# Altium project Battman.PrjPcb (part 2 of 2)

## Sheet CAN.SchDoc
size A; SheetNumber: 9
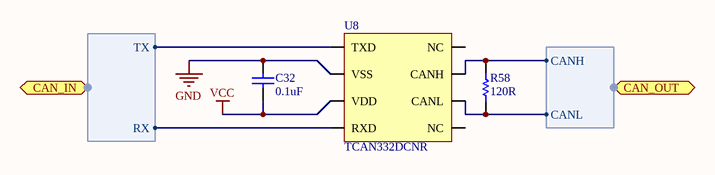
[diagram p9: CAN.SchDoc]

### Parts
C32  value 0.1uF  [C0402[1005X55]]  (hidden comment: 0.1uF 6.3V 0402)
R58  value 120R  [R0402[1005]]  (hidden comment: 120R 1% 0402)
U8  TCAN332DCNR  [SOT-23-8]

### Ports
CAN_IN (harness CAN Input), CAN_OUT (harness CAN Output)

### Harnesses
CAN Input: TX, RX
CAN Output: CANH, CANL

### Nets
GND: C32.1 U8.2(VSS)
VCC: C32.2 U8.3(VDD)
CAN.RX: U8.4(RXD) ; port CAN_IN.RX
CAN.TX: U8.1(TXD) ; port CAN_IN.TX
NetJP3_1: R58.2 U8.7(CANH) ; port CAN_OUT.CANH
NetJP3_2: R58.1 U8.6(CANL) ; port CAN_OUT.CANL

Not connected (* = marked no-connect by the designer): U8 5(NC) 8(NC)

### Library data of the parts
C32 = CAP_0.1uF_6.3V_0402_10%: 0.1uF 6.3V 10% 0402 (1005 Metric); PartNumber: GRM155R70J104KA01D; Manufacturer: Murata; Tolerance: 10%; Mounting Technology: Surface Mount; PackageReference: 0402; PackageDescription: 0402 (1005 Metric); Voltage: 6.3V
R58 = RES_120R_0402_1%: 120R 0.063W 1% 0402 (1005 Metric); Manufacturer: KOA Speer; PartNumber: RK73H1ETTP1200F; Tolerance: 1%; Power: 0.063W; Mounting Technology: Surface Mount; PackageReference: 0402; PackageDescription: 0402 (1005 Metric); ComponentLink1Description: Datasheet; ComponentLink1URL: http://www.koaspeer.com/catimages/Products/RK73H/RK73H.pdf
U8 = TCAN332DCNR: CAN Interface IC 3.3-V CAN Transceivers with CAN FD (Flexible Data Rate) 8-SOT-23 -40 to 125; Manufacturer: Texas Instruments; Mounting Technology: Surface Mount; PackageReference: SOT-23-8; PackageDescription: SOT23, 8-Leads; PartNumber: TCAN332DCNR

## Sheet RTCC.SchDoc
size A; SheetNumber: 10
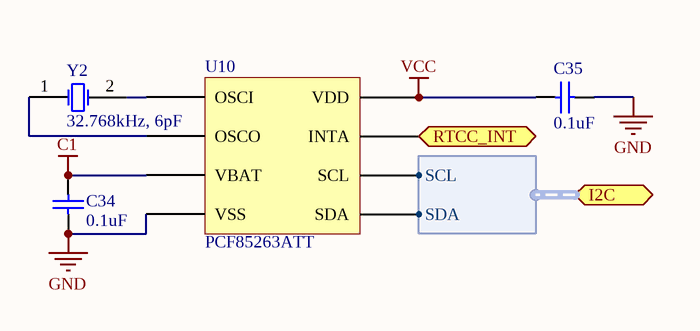
[diagram p10: RTCC.SchDoc]

### Parts
C34  value 0.1uF  [C0402[1005X55]]  (hidden comment: 0.1uF 6.3V 0402)
C35  value 0.1uF  [C0402[1005X55]]  (hidden comment: 0.1uF 6.3V 0402)
U10  PCF85263ATT  [TSSOP-8]
Y2  32.768kHz, 6pF  [ST3215SB]

### Ports
I2C (harness I2C), RTCC_INT (out)

### Harnesses
I2C: SCL, SDA

### Nets
C1: C34.2 U10.3(VBAT)
GND: C34.1 C35.2 U10.4(VSS)
VCC: C35.1 U10.8(VDD)
I2C.SCL: U10.6(SCL) ; port I2C.SCL
I2C.SDA: U10.5(SDA) ; port I2C.SDA
NetQ9_1: U10.7(INTA) ; port RTCC_INT
NetU10_1: U10.1(OSCI) Y2.2(X2)
NetU10_2: U10.2(OSCO) Y2.1(X1)

### Library data of the parts
C34 C35 = CAP_0.1uF_6.3V_0402_10%: as C32 on sheet CAN; Mounting Technology: Surface Mount; PackageReference: 0402; PackageDescription: 0402 (1005 Metric); Voltage: 6.3V; Tolerance: 10%
U10 = PCF85263ATT: Real Time Clock Real-Time Clock calendar; PartNumber: PCF85263ATT/AJ; Manufacturer: Texas Instruments; Mounting Technology: Surface Mount; PackageReference: TSSOP-8
Y2 = ST3215SB32768B0HPWB3: 32.768kHz ±20ppm Crystal 6pF 60 kOhm -40°C ~ 85°C Surface Mount 2-SMD, No Lead (DFN, LCC); Manufacturer: AVX/Kyocera; PackageDescription: 2-SMD, No Lead (DFN, LCC); PackageReference: ST3215SB; Mounting Technology: Surface Mount; PartNumber: ST3215SB32768B0HPWB3

## Sheet Buzzer.SchDoc
size A; SheetNumber: 11
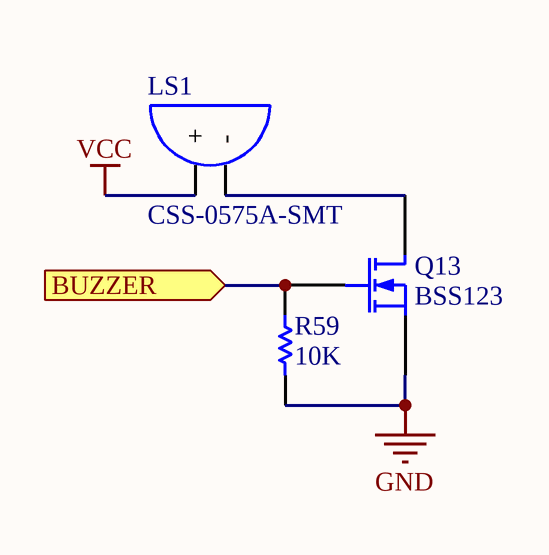
[diagram p11: Buzzer.SchDoc]

### Parts
LS1  CSS-0575A-SMT  [CSS-0575A-SMT]
Q13  BSS123  [SOT323-3]
R59  value 10K  [R0402[1005]]  (hidden comment: 10K 1% 0402)

### Ports
BUZZER (in)

### Nets
GND: Q13.2(S) R59.1
VCC: LS1.1(+)
NetLS1_2: LS1.2(-) Q13.3(D)
NetQ13_1: Q13.1(G) R59.2 ; port BUZZER

### Library data of the parts
LS1 = CSS-0575A-SMT: Magnetic Buzzer Transducer; Manufacturer: CUI, Inc.; PartNumber: CSS-0575A-SMT; Mounting Technology: Surface Mount; PackageReference: 5x5x1.9mm
Q13 = BSS123WQ-7-F: N-Channel MOSFET; Manufacturer: Diodes Incorporated; PackageReference: SOT-323-3; PartNumber: BSS123WQ-7-F; Mounting Technology: Surface Mount
R59 = RES_10K_0402_1%: 10K 0.063W 1% 0402 (1005 Metric); Manufacturer: KOA Speer; PartNumber: RK73H1ETTP1002F; Tolerance: 1%; Power: 0.063W; Mounting Technology: Surface Mount; PackageReference: 0402; PackageDescription: 0402 (1005 Metric); ComponentLink1Description: Datasheet; ComponentLink1URL: http://www.koaspeer.com/catimages/Products/RK73H/RK73H.pdf

## Sheet Flash.SchDoc
size A; SheetNumber: 12
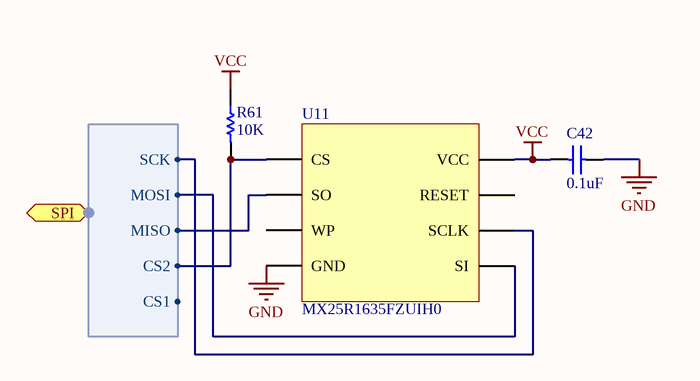
[diagram p12: Flash.SchDoc]

### Parts
C42  value 0.1uF  [C0402[1005X55]]  (hidden comment: 0.1uF 6.3V 0402)
R61  value 10K  [R0402[1005]]  (hidden comment: 10K 1% 0402)
U11  MX25R1635FZUIH0  [USON-8]

### Ports
SPI (harness SPI)

### Harnesses
SPI: SCK, MOSI, MISO, CS2, CS1

### Nets
GND: C42.2 U11.4(GND)
VCC: C42.1 R61.2 U11.8(VCC)
SPI.CS2: R61.1 U11.1(CS) ; port SPI.CS2
SPI.MISO: U11.2(SO) ; port SPI.MISO
SPI.MOSI: U11.5(SI) ; port SPI.MOSI
SPI.SCK: U11.6(SCLK) ; port SPI.SCK

Not connected (* = marked no-connect by the designer): U11 3(WP) 7(RESET)

### Library data of the parts
C42 = CAP_0.1uF_6.3V_0402_10%: as C32 on sheet CAN; Mounting Technology: Surface Mount; PackageReference: 0402; PackageDescription: 0402 (1005 Metric); Voltage: 6.3V; Tolerance: 10%
R61 = RES_10K_0402_1%: as R59 on sheet Buzzer; Tolerance: 1%; Power: 0.063W; Mounting Technology: Surface Mount; PackageReference: 0402; PackageDescription: 0402 (1005 Metric); ComponentLink1Description: Datasheet; ComponentLink1URL: http://www.koaspeer.com/catimages/Products/RK73H/RK73H.pdf
U11 = MX25R1635FZUIH0: pin to pad: 4>4+9; Manufacturer: Macronix; PartNumber: MX25R1635FZUIH0; Mounting Technology: Surface Mount; PackageReference: USON-8

## Nets that join several sheets
5V: 3V3 (5 pins), Connectors (JP5.5)
B+: Switches (D16.1), CurrentSense (R53.2)
C1: Switches (D18.1 Q9.2 R41.2), Connectors (*1.2), RTCC (C34.2 U10.3)
C+: Switches (R38.2), Charging (6 pins)
CHG+: Switches (5 pins), Charging (C22.1 D5.1 D6.1 R32.2), Connectors (JP4.2)
GND: 3V3 (16 pins), MCU (20 pins), Switches (21 pins), LTC6803 (5 pins), Charging (18 pins), Connectors (JP2.2 JP5.1 JP6.5 JP6.6), CurrentSense (C33.1 U9.1 U9.2 U9.7), CAN (C32.1 U8.2), RTCC (C34.1 C35.2 U10.4), Buzzer (Q13.2 R59.1), Flash (C42.2 U11.4)
V-: LTC6803 (5 pins), U_LTC6803/12 (C23_12.1), U_LTC6803/11 (C23_11.1), U_LTC6803/10 (C23_10.1), U_LTC6803/9 (C23_9.1), U_LTC6803/8 (C23_8.1), U_LTC6803/7 (C23_7.1), U_LTC6803/6 (C23_6.1), U_LTC6803/5 (C23_5.1), U_LTC6803/4 (C23_4.1), U_LTC6803/3 (C23_3.1), U_LTC6803/2 (C23_2.1), U_LTC6803/1 (C23_1.1)
VBB: Switches (8 pins), CurrentSense (R53.1)
VCC: 3V3 (5 pins), MCU (19 pins), Switches (U7.5 U7.7), LTC6803 (R1.1 R2.1 R3.1 R8.2), Charging (6 pins), Connectors (JP5.4), CurrentSense (C33.2 R52.2 U9.6), CAN (C32.2 U8.3), RTCC (C35.1 U10.8), Buzzer (LS1.1), Flash (C42.1 R61.2 U11.8)
VDD: 3V3 (C24.2 U5.2 U5.3), Switches (Q7.2 R57.2), LTC6803 (L1.1)
VUSB: 3V3 (D11.2 D15.1), MCU (R14.2), Connectors (JP6.1)
CELL0: LTC6803 (R10.2), U_LTC6803/1 (D9_1.C R35_1.1), Connectors (JP1.1)
CELL1: U_LTC6803/2 (D9_2.C R35_2.1), U_LTC6803/1 (Q3_1.2 R34_1.2), Connectors (*1.1 JP1.2)
CELL2: U_LTC6803/3 (D9_3.C R35_3.1), U_LTC6803/2 (Q3_2.2 R34_2.2), Connectors (JP1.3)
CELL3: U_LTC6803/4 (D9_4.C R35_4.1), U_LTC6803/3 (Q3_3.2 R34_3.2), Connectors (JP1.4)
CELL4: U_LTC6803/5 (D9_5.C R35_5.1), U_LTC6803/4 (Q3_4.2 R34_4.2), Connectors (JP1.5)
CELL5: U_LTC6803/6 (D9_6.C R35_6.1), U_LTC6803/5 (Q3_5.2 R34_5.2), Connectors (JP1.6)
CELL6: U_LTC6803/7 (D9_7.C R35_7.1), U_LTC6803/6 (Q3_6.2 R34_6.2), Connectors (JP1.7)
CELL7: U_LTC6803/8 (D9_8.C R35_8.1), U_LTC6803/7 (Q3_7.2 R34_7.2), Connectors (JP1.8)
CELL8: U_LTC6803/9 (D9_9.C R35_9.1), U_LTC6803/8 (Q3_8.2 R34_8.2), Connectors (JP1.9)
CELL9: U_LTC6803/10 (D9_10.C R35_10.1), U_LTC6803/9 (Q3_9.2 R34_9.2), Connectors (JP1.10)
CELL10: U_LTC6803/11 (D9_11.C R35_11.1), U_LTC6803/10 (Q3_10.2 R34_10.2), Connectors (JP1.11)
CELL11: U_LTC6803/12 (D9_12.C R35_12.1), U_LTC6803/11 (Q3_11.2 R34_11.2), Connectors (JP1.12)
CELL12: U_LTC6803/12 (Q3_12.2 R34_12.2), Connectors (JP1.13)
I2C.SCL: Charging (U4.3), CurrentSense (U9.5), RTCC (U10.6)
I2C.SDA: Charging (U4.4), CurrentSense (U9.4), RTCC (U10.5)
NetC1_2: LTC6803 (C1.2 R4.1 U1.32), Connectors (JP2.1)
NetC5_2: LTC6803 (C5.2 R10.1 U1.29), U_LTC6803/1 (D8_1.2)
NetC23_1_2: LTC6803 (U1.27), U_LTC6803/2 (D8_2.2), U_LTC6803/1 (C23_1.2 D8_1.1 R34_1.1)
NetC23_2_2: LTC6803 (U1.25), U_LTC6803/3 (D8_3.2), U_LTC6803/2 (C23_2.2 D8_2.1 R34_2.1)
NetC23_3_2: LTC6803 (U1.23), U_LTC6803/4 (D8_4.2), U_LTC6803/3 (C23_3.2 D8_3.1 R34_3.1)
NetC23_4_2: LTC6803 (U1.21), U_LTC6803/5 (D8_5.2), U_LTC6803/4 (C23_4.2 D8_4.1 R34_4.1)
NetC23_5_2: LTC6803 (U1.19), U_LTC6803/6 (D8_6.2), U_LTC6803/5 (C23_5.2 D8_5.1 R34_5.1)
NetC23_6_2: LTC6803 (U1.17), U_LTC6803/7 (D8_7.2), U_LTC6803/6 (C23_6.2 D8_6.1 R34_6.1)
NetC23_7_2: LTC6803 (U1.15), U_LTC6803/8 (D8_8.2), U_LTC6803/7 (C23_7.2 D8_7.1 R34_7.1)
NetC23_8_2: LTC6803 (U1.13), U_LTC6803/9 (D8_9.2), U_LTC6803/8 (C23_8.2 D8_8.1 R34_8.1)
NetC23_9_2: LTC6803 (U1.11), U_LTC6803/10 (D8_10.2), U_LTC6803/9 (C23_9.2 D8_9.1 R34_9.1)
NetC23_10_2: LTC6803 (U1.9), U_LTC6803/11 (D8_11.2), U_LTC6803/10 (C23_10.2 D8_10.1 R34_10.1)
NetC23_11_2: LTC6803 (U1.7), U_LTC6803/12 (D8_12.2), U_LTC6803/11 (C23_11.2 D8_11.1 R34_11.1)
NetC23_12_2: LTC6803 (U1.5), U_LTC6803/12 (C23_12.2 D8_12.1 R34_12.1)
NetJP3_1: Connectors (JP3.1), CAN (R58.2 U8.7)
NetJP3_2: Connectors (JP3.2), CAN (R58.1 U8.6)
NetJP4_1: Switches (R46.2), Connectors (JP4.1)
NetQ1_1: MCU (Q1.1), Switches (Q12.1 R46.1 R47.2)
NetQ3_1_1: LTC6803 (U1.28), U_LTC6803/1 (Q3_1.1)
NetQ3_2_1: LTC6803 (U1.26), U_LTC6803/2 (Q3_2.1)
NetQ3_3_1: LTC6803 (U1.24), U_LTC6803/3 (Q3_3.1)
NetQ3_4_1: LTC6803 (U1.22), U_LTC6803/4 (Q3_4.1)
NetQ3_5_1: LTC6803 (U1.20), U_LTC6803/5 (Q3_5.1)
NetQ3_6_1: LTC6803 (U1.18), U_LTC6803/6 (Q3_6.1)
NetQ3_7_1: LTC6803 (U1.16), U_LTC6803/7 (Q3_7.1)
NetQ3_8_1: LTC6803 (U1.14), U_LTC6803/8 (Q3_8.1)
NetQ3_9_1: LTC6803 (U1.12), U_LTC6803/9 (Q3_9.1)
NetQ3_10_1: LTC6803 (U1.10), U_LTC6803/10 (Q3_10.1)
NetQ3_11_1: LTC6803 (U1.8), U_LTC6803/11 (Q3_11.1)
NetQ3_12_1: LTC6803 (U1.6), U_LTC6803/12 (Q3_12.1)
NetQ9_1: MCU (U2.43), Switches (Q9.1 R41.1), RTCC (U10.7)
NetQ11_1: MCU (U2.19), Switches (Q11.1 R45.2)
NetQ13_1: MCU (U2.28), Buzzer (Q13.1 R59.2)
NetR22_1: MCU (R22.1), Switches (U7.10)
NetR39_1: MCU (U2.18), Switches (R39.1 R40.2)
NetR52_1: MCU (U2.25), CurrentSense (R52.1 U9.3)
NetU2_40: MCU (U2.40), Switches (U7.8)
NetU2_41: MCU (U2.41), Switches (U7.6)
NetU2_42: MCU (U2.42), Switches (U7.4)
SPI.MISO: LTC6803 (R8.1 U1.43), Flash (U11.2)
SPI.MOSI: LTC6803 (R2.2 U1.42), Flash (U11.5)
SPI.SCK: LTC6803 (R1.2 U1.41), Flash (U11.6)